# Altium schematic sheet Microcontroller.SchDoc
size B; SheetNumber: 11; SheetTotal: 11; TitleBlk1Sch: PCBA, LUCHADOR, REV 3.2b, AMBER; TitleBlk2Sch: Microcontroller; Eng: Haman; EngDate: 3-15-19; RevSch: 01
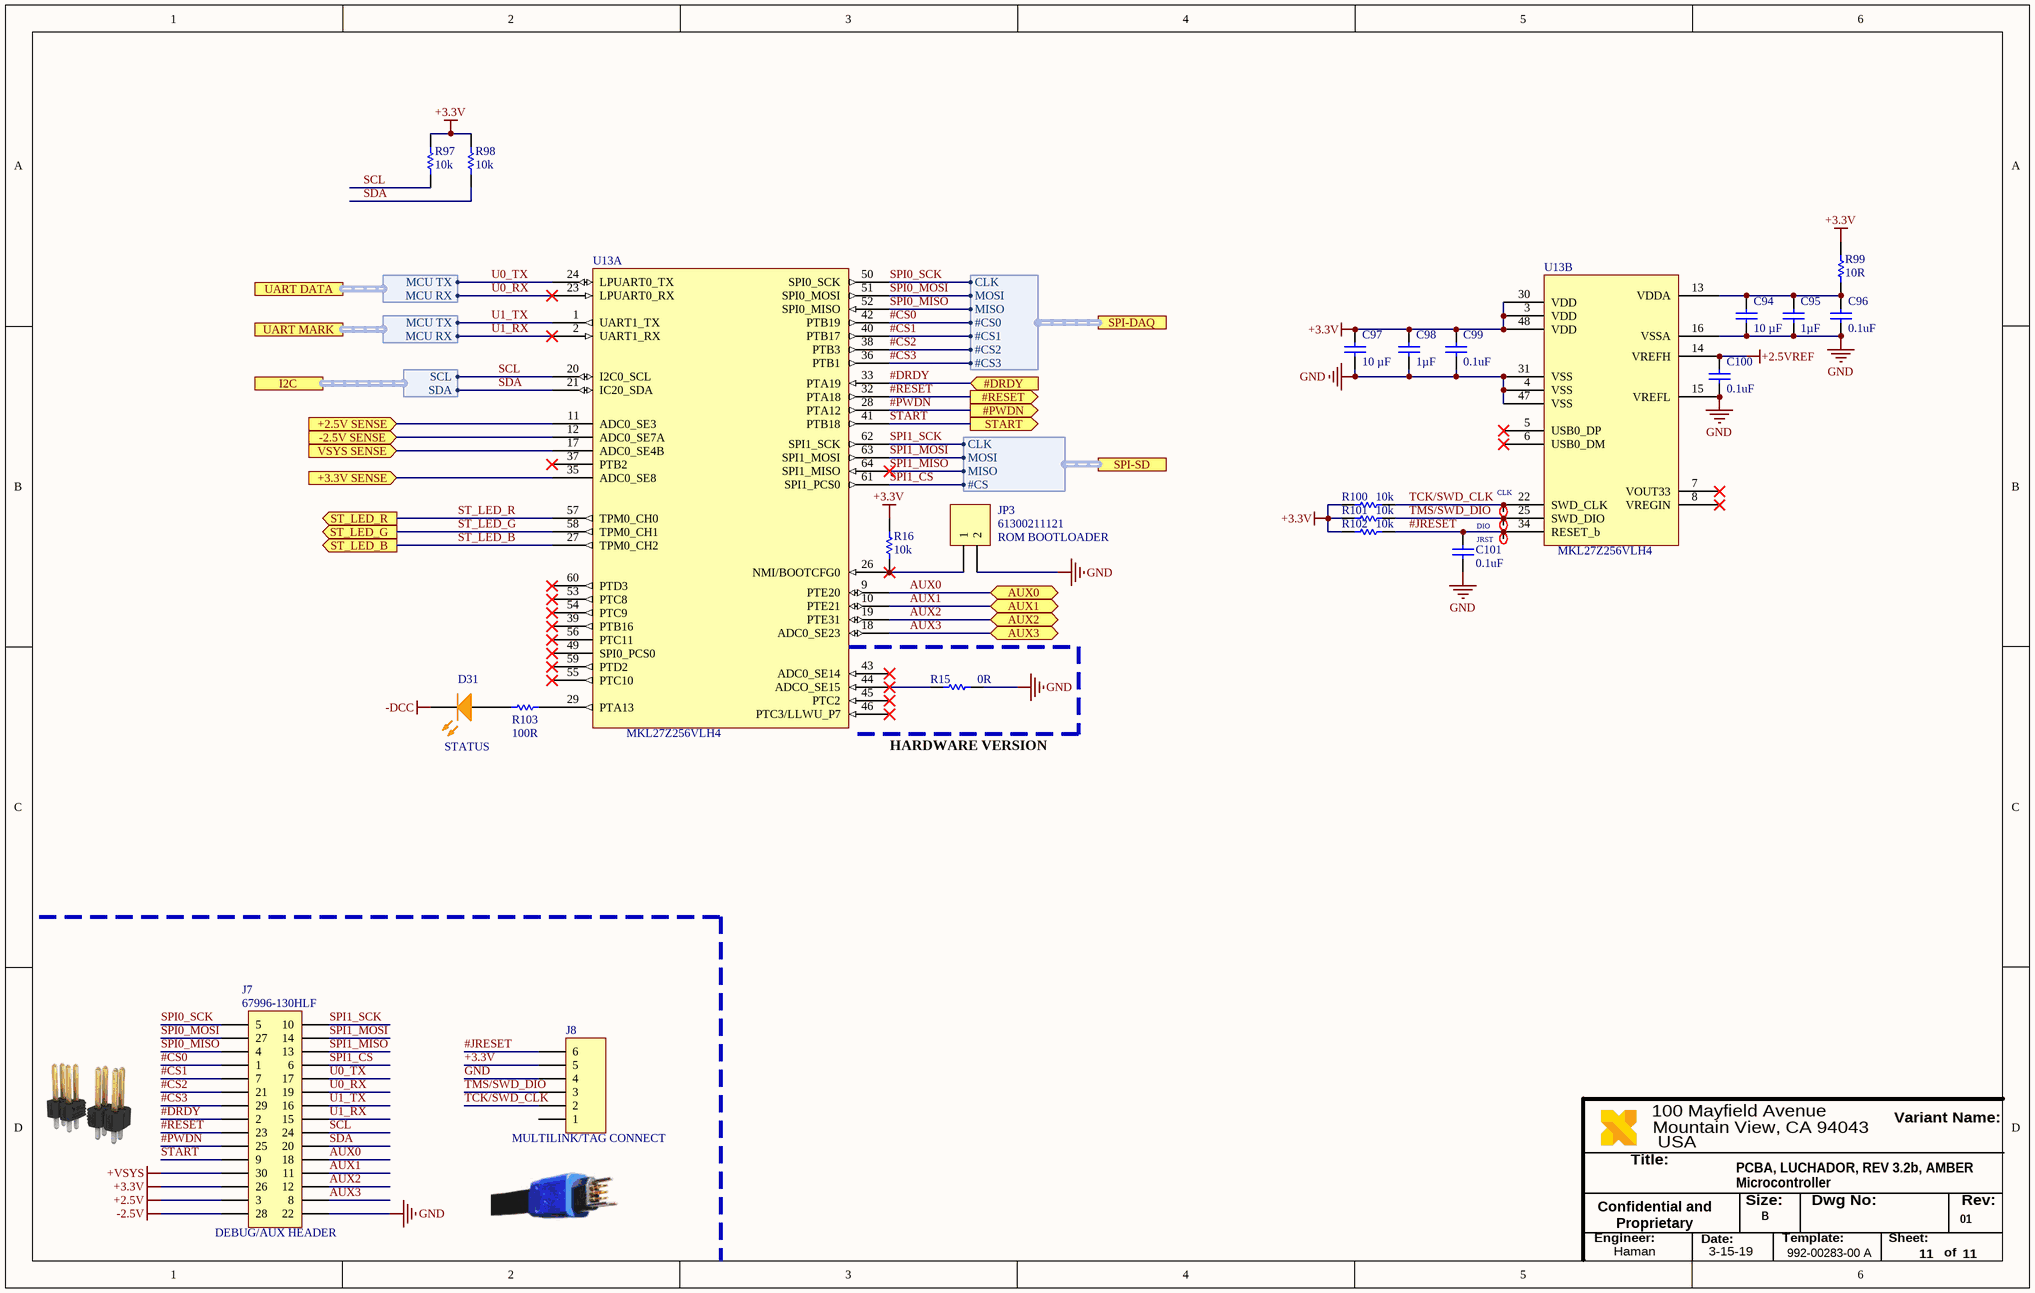
[diagram p0: Microcontroller.SchDoc]

## Parts
C94  Capacitance: 10 µF  [0603C]  (hidden comment: 50V)
C95  Capacitance: 1µF  [0402C]  (hidden comment: 50V)
C96  Capacitance: 0.1uF  [0402C]  (hidden comment: 50V)
C97  Capacitance: 10 µF  [0603C]  (hidden comment: 50V)
C98  Capacitance: 1µF  [0402C]  (hidden comment: 50V)
C99  Capacitance: 0.1uF  [0402C]  (hidden comment: 50V)
C100  Capacitance: 0.1uF  [0402C]  (hidden comment: 50V)
C101  Capacitance: 0.1uF  [0402C]  (hidden comment: 50V)
CLK  5001  [KEYSTONE TP]  (value not drawn)  (no BOM)
D31  STATUS  [0402L-ORANGE]
DIO  5001  [KEYSTONE TP]  (value not drawn)  (no BOM)
J7  DEBUG/AUX HEADER  [67996-130HLF]
J8  MULTILINK/TAG CONNECT  [TAG_CONNECT]  (no BOM)
JP3  ROM BOOTLOADER  [61300211121]
JRST  5001  [KEYSTONE TP]  (value not drawn)  (no BOM)
R15  Resistance (Ohms): 0R  [0402R]  (hidden comment: Res 0805)
R16  Resistance: 10k  [0402R]  (hidden comment: Res 0805)
R97  Resistance: 10k  [0402R]  (hidden comment: Res 0805)
R98  Resistance: 10k  [0402R]  (hidden comment: Res 0805)
R99  Resistance: 10R  [0402R]  (hidden comment: Res 0805)
R100  Resistance: 10k  [0402R]  (hidden comment: Res 0805)
R101  Resistance: 10k  [0402R]  (hidden comment: Res 0805)
R102  Resistance: 10k  [0402R]  (hidden comment: Res 0805)
R103  Resistance: 100R  [0402R]  (hidden comment: Res 0805)
U13  Manufacturer Part Number: MKL27Z256VLH4  [LQFP-64]  (hidden comment: MKL26Z256VLH4)  (parts A,B of 2)

## Ports
#DRDY (in), #PWDN (out), #RESET (out), +2.5V SENSE (in), +3.3V SENSE (in), -2.5V SENSE (in), AUX0 (bidir), AUX1 (bidir), AUX2 (bidir), AUX3 (bidir), I2C (harness I2C), SPI-DAQ (harness SPI-DAQ), SPI-SD (harness SPI-SD), ST_LED_B (out), ST_LED_G (out), ST_LED_R (out), START (out), UART DATA (harness UART), UART MARK (harness UART), VSYS SENSE (in)

## Harnesses
UART: MCU TX, MCU RX
I2C: SCL, SDA
SPI-DAQ: MOSI, MISO, CLK, #CS0, #CS1, #CS2, #CS3
SPI-SD: MISO, MOSI, CLK, #CS

## Nets
+2.5V: J7.3
+2.5VREF: C100.1 U13.14(VREFH)
+3.3V: C97.1 C98.1 C99.1 J7.26 J8.5 R16.2 R97.2 R98.2 R99.2 R100.1 R101.1 R102.1 U13.3(VDD) U13.30(VDD) U13.48(VDD)
+VSYS: J7.30
-2.5V: J7.28
-DCC: D31.2(K)
GND: C94.2 C95.2 C96.2 C97.2 C98.2 C99.2 C100.2 C101.2 J7.22 J8.4 JP3.2 R15.2 U13.4(VSS) U13.15(VREFL) U13.16(VSSA) U13.31(VSS) U13.47(VSS)
#CS0: J7.1 U13.42(PTB19) ; port SPI-DAQ.#CS0
#CS1: J7.7 U13.40(PTB17) ; port SPI-DAQ.#CS1
#CS2: J7.21 U13.38(PTB3) ; port SPI-DAQ.#CS2
#CS3: J7.29 U13.36(PTB1) ; port SPI-DAQ.#CS3
#DRDY: J7.2 U13.33(PTA19) ; port #DRDY
#JRESET: C101.1 J8.6 JRST.1 R102.2 U13.34(RESET_b)
#PWDN: J7.25 U13.28(PTA12) ; port #PWDN
#RESET: J7.23 U13.32(PTA18) ; port #RESET
+2.5V SENSE: U13.11(ADC0_SE3) ; port +2.5V SENSE
+3.3V SENSE: U13.35(ADC0_SE8) ; port +3.3V SENSE
-2.5V SENSE: U13.12(ADC0_SE7A) ; port -2.5V SENSE
AUX0: J7.18 U13.9(PTE20) ; port AUX0
AUX1: J7.11 U13.10(PTE21) ; port AUX1
AUX2: J7.12 U13.19(PTE31) ; port AUX2
AUX3: J7.8 U13.18(ADC0_SE23) ; port AUX3
SCL: J7.24 R97.1 U13.20(I2C0_SCL) ; port I2C.SCL
SDA: J7.20 R98.1 U13.21(IC20_SDA) ; port I2C.SDA
SPI0_MISO: J7.4 U13.52(SPI0_MISO) ; port SPI-DAQ.MISO
SPI0_MOSI: J7.27 U13.51(SPI0_MOSI) ; port SPI-DAQ.MOSI
SPI0_SCK: J7.5 U13.50(SPI0_SCK) ; port SPI-DAQ.CLK
SPI1_CS: J7.6 U13.61(SPI1_PCS0) ; port SPI-SD.#CS
SPI1_MISO: J7.13 U13.64(SPI1_MISO) ; port SPI-SD.MISO
SPI1_MOSI: J7.14 U13.63(SPI1_MOSI) ; port SPI-SD.MOSI
SPI1_SCK: J7.10 U13.62(SPI1_SCK) ; port SPI-SD.CLK
ST_LED_B: U13.27(TPM0_CH2) ; port ST_LED_B
ST_LED_G: U13.58(TPM0_CH1) ; port ST_LED_G
ST_LED_R: U13.57(TPM0_CH0) ; port ST_LED_R
START: J7.9 U13.41(PTB18) ; port START
TCK/SWD_CLK: CLK.1 J8.2 R100.2 U13.22(SWD_CLK)
TMS/SWD_DIO: DIO.1 J8.3 R101.2 U13.25(SWD_DIO)
U0_RX: J7.19 U13.23(LPUART0_RX) ; port UART DATA.MCU RX
U0_TX: J7.17 U13.24(LPUART0_TX) ; port UART DATA.MCU TX
U1_RX: J7.15 U13.2(UART1_RX) ; port UART MARK.MCU RX
U1_TX: J7.16 U13.1(UART1_TX) ; port UART MARK.MCU TX
VSYS SENSE: U13.17(ADC0_SE4B) ; port VSYS SENSE
NetC94_1: C94.1 C95.1 C96.1 R99.1 U13.13(VDDA)
NetD31_1: D31.1(A) R103.1
NetJP3_1: JP3.1 R16.1 U13.26(NMI/BOOTCFG0)
NetR15_1: R15.1 U13.44(ADCO_SE15)
NetR103_2: R103.2 U13.29(PTA13)

Not connected (* = marked no-connect by the designer): J8 1; U13 5(USB0_DP)* 6(USB0_DM)* 7(VOUT33)* 8(VREGIN)* 37(PTB2)* 39(PTB16)* 43(ADC0_SE14)* 45(PTC2)* 46(PTC3/LLWU_P7)* 49(SPI0_PCS0)* 53(PTC8)* 54(PTC9)* 55(PTC10)* 56(PTC11)* 59(PTD2)* 60(PTD3)*

## Notes on the sheet
- HARDWARE VERSION
- Title:
- USA
- 100 Mayfield Avenue
- Mountain View, CA 94043
- Variant Name:
- Confidential and Proprietary
- Engineer:
- Date:
- Size:
- B
- Template:
- 992-00283-00 A
- Dwg No:
- Sheet:
- Rev:
- of

## Library data of the parts
C94 C97 = Cap: CAP .1UF 50V CERAMIC Y5V 0805; Manufacturer: Samsung; Manufacturer Part Number: CL10B106MQ8NRNC; Description1: 10µF ±20% 6.3V X7R Ceramic Capacitor -55°C ~ 125°C Surface Mount, MLCC 0603 (1608 Metric) 0.063" L x 0.031" W (1.60mm x 0.80mm); Dielectric: X7R; Tolerance (%): ±20 %; Rated Voltage: 6.3 V; Revision: July-2002: Re-released for DXP Platform.; Supplier 1: Digi-Key; Supplier Part Number 1: 1276-1948-1-ND; Stock 1: 40000; Pricing 1: 1=1.07, 10=0.813, 100=0.5813, 500=0.45, 1000=0.3875 (USD); Case Size/Dimension: 0603; ComponentLink1URL: https://datasheet.ciiva.com/25723/cl10b106mq8nrnc-25723233.pdf; ComponentLink1Description: https://datasheet.ciiva.com/25723/cl10b106mq8nrnc-25723233.pdf; ComponentLink2URL: https://datasheet.ciiva.com/16428/cl10b106mq8nrnc-16428858.pdf; ComponentLink2Description: https://datasheet.ciiva.com/16428/cl10b106mq8nrnc-16428858.pdf
C95 C98 = Cap: CAP .1UF 50V CERAMIC Y5V 0805; Manufacturer: TDK; Manufacturer Part Number: CGB2A1JB1C105K033BC; PCN Part Number: MLCC Part Number Change 30/Nov/2012; Description1: 1µF ±10% 16V JB Ceramic Capacitor -25°C ~ 85°C Surface Mount, MLCC 0402 (1005 Metric) 0.039" L x 0.020" W (1.00mm x 0.50mm); Product Training Modules: SEAT, CCV, and TVCL Design Tools Guide to Replacing an Electrolytic Capacitor with an MLCC; Featured Product: CGB Series Capacitors CH and JB Temperature Coefficient Capacitors; EDA / CAD Models: Download from Accelerated Designs; Tolerance: ±10%; Voltage - Rated: 16V; Temperature Coefficient: JB; Online Catalog: CGB Series; Other Names: 445-12011-6; Revision: July-2002: Re-released for DXP Platform.; Supplier 1: Digi-Key; Supplier Part Number 1: 445-12011-1-ND; Stock 1: 7430; Pricing 1: 1=0.22, 10=0.151, 100=0.0765, 500=0.0523, 1000=0.0463, 2500=0.0443, 5000=0.0403 (USD); RoHS Information: RoHS Certificate-MLCC; Standard Package: 1; Category: Capacitors; Family: Ceramic Capacitors; Series: CGB; Packaging: Digi-Reel®; Mounting Type: Surface Mount, MLCC; Operating Temperature: -25°C ~ 85°C; Applications: General Purpose; Package / Case: 0402 (1005 Metric); Size / Dimension: 0.039" L x 0.020" W (1.00mm x 0.50mm); Thickness (Max): 0.013" (0.33mm); Features: Low Profile; ComponentLink1URL: https://product.tdk.com/info/en/catalog/datasheets/mlcc_commercial_lowprofile_en.pdf; ComponentLink1Description: https://product.tdk.com/info/en/catalog/datasheets/mlcc_commercial_lowprofile_en.pdf; ComponentLink2URL: https://product.tdk.com/info/en/catalog/spec/mlccspec_commercial_lowprofile_en.pdf; ComponentLink2Description: https://product.tdk.com/info/en/catalog/spec/mlccspec_commercial_lowprofile_en.pdf; ComponentLink3URL: http://product.tdk.com/en/catalog/datasheets/mlcc_commercial_lowprofile_en.pdf; ComponentLink3Description: http://product.tdk.com/en/catalog/datasheets/mlcc_commercial_lowprofile_en.pdf
C96 C99-C101 = Cap: CAP .1UF 50V CERAMIC Y5V 0805; Manufacturer: Kyocera AVX; Manufacturer Part Number: 0402YD104KAT2A; Description1: AVX   0402YD104KAT2A   Multilayer Ceramic Capacitor, 0.1 F,  10%, X5R, 16 V, 0402 [1005 Metric]; Dielectric: X5R; Tolerance (%): ±10 %; Rated Voltage: 16 V; Revision: July-2002: Re-released for DXP Platform.; Supplier 1: Digi-Key; Supplier Part Number 1: 478-1126-1-ND; Stock 1: 0; Pricing 1: 1=0.1, 10=0.047, 100=0.0211, 500=0.0151, 1000=0.0119, 2500=0.0108, 5000=0.0099 (USD); Case Size/Dimension: 0402; ComponentLink1URL: https://datasheet.ciiva.com/2987/cx5r-2987712.pdf; ComponentLink1Description: https://datasheet.ciiva.com/2987/cx5r-2987712.pdf; ComponentLink2URL: https://datasheet.ciiva.com/150/cx5r-150353.pdf; ComponentLink2Description: https://datasheet.ciiva.com/150/cx5r-150353.pdf; ComponentLink3URL: https://datasheet.ciiva.com/150/cx5r-150354.pdf; ComponentLink3Description: https://datasheet.ciiva.com/150/cx5r-150354.pdf; ComponentLink4URL: https://datasheet.ciiva.com/11786/0900766b80def1a5-11786866.pdf; ComponentLink4Description: https://datasheet.ciiva.com/11786/0900766b80def1a5-11786866.pdf; ComponentLink5URL: https://datasheet.ciiva.com/150/cx5r-150355.pdf; ComponentLink5Description: https://datasheet.ciiva.com/150/cx5r-150355.pdf; ComponentLink6URL: https://datasheet.ciiva.com/1124/1666675-1124009.pdf; ComponentLink6Description: https://datasheet.ciiva.com/1124/1666675-1124009.pdf; ComponentLink7URL: https://datasheet.ciiva.com/5423/cx5r-33896-5423625.pdf; ComponentLink7Description: https://datasheet.ciiva.com/5423/cx5r-33896-5423625.pdf; ComponentLink8URL: https://datasheet.ciiva.com/1124/1666675-1124010.pdf; ComponentLink8Description: https://datasheet.ciiva.com/1124/1666675-1124010.pdf; ComponentLink9URL: https://datasheet.ciiva.com/14590/70001028-14590205.pdf; ComponentLink9Description: https://datasheet.ciiva.com/14590/70001028-14590205.pdf; ComponentLink10URL: https://datasheet.ciiva.com/14592/70001028-14592157.pdf; ComponentLink10Description: https://datasheet.ciiva.com/14592/70001028-14592157.pdf; ComponentLink11URL: https://datasheet.ciiva.com/16623/cx5r-16623293.pdf; ComponentLink11Description: https://datasheet.ciiva.com/16623/cx5r-16623293.pdf; ComponentLink12URL: https://datasheet.ciiva.com/34303/1928960-34303277.pdf; ComponentLink12Description: https://datasheet.ciiva.com/34303/1928960-34303277.pdf; ComponentLink13URL: https://datasheet.ciiva.com/2987/cx5r-2987711.pdf; ComponentLink13Description: https://datasheet.ciiva.com/2987/cx5r-2987711.pdf
CLK DIO JRST = 5001: Manufacturer: Keystone Electronics; Description1: TEST POINT PC MINI .040"D BLACK; Supplier 1: Digi-Key; Manufacturer Part Number: 5001; RoHS: RoHS Compliant; Category: Test and Measurement; Stock 1: 159085; Pricing 1: 1=0.34, 10=0.315, 50=0.2296, 100=0.2206, 250=0.19812, 500=0.1891, 1000=0.15759, 2500=0.14408, 5000=0.13508 (USD); Packaging: Bulk; Type: PC Test Point, Miniature; Terminal: 0.010" x 0.020" (0.25mm x 0.51mm) Phosphor Bronze Wire, Silver Plated; Mounting Type: 0.040" (1.02mm) Hole Diameter; Material: Base, Nylon 46, UL 94V-0; Color: Black; ComponentLink1URL: http://www.keyelco.com/product-pdf.cfm?p=1310; ComponentLink1Description: http://www.keyelco.com/product-pdf.cfm?p=1310; Supplier Part Number 1: 5001K-ND
D31 = LED0_1: Typical INFRARED GaAs LED; Manufacturer: Vishay; Manufacturer Part Number: VLMO1500-GS08; Description1: Standard LEDs - SMD 0402 SOFT ORANGE Non-Diff; Illumination Color: Orange; Wavelength/Color Temperature: 605 nm; Luminous Intensity: 90 mcd; Viewing Angle: 130 deg; Lens Color/Style: Water Clear; If - Forward Current: 30 mA; Vf - Forward Voltage: 2 V; Power Rating: 75 mW; Brand: Vishay Semiconductors; Supplier 1: Digi-Key; Supplier Part Number 1: VLMO1500-GS08CT-ND; Stock 1: 194938; Pricing 1: 1=0.53, 10=0.38, 25=0.2916, 100=0.1901, 250=0.1394, 500=0.1183, 1000=0.0972 (USD); Product Category: Standard LEDs - SMD; RoHS: True; Package / Case: 0402 (1005 metric); Length: 1 mm; Height: 0.35 mm; Width: 0.5 mm; Minimum Operating Temperature: - 30 C; Maximum Operating Temperature: + 85 C; Series: VLMx; Packaging: Reel; Mounting Style: SMD/SMT; Factory Pack Quantity: 9000; Tradename: ChipLED; ComponentLink1URL: https://datasheet.ciiva.com/13945/vlmo1500-13945355.pdf; ComponentLink1Description: https://datasheet.ciiva.com/13945/vlmo1500-13945355.pdf; ComponentLink2URL: https://datasheet.ciiva.com/13945/vlmo1500-13945356.pdf; ComponentLink2Description: https://datasheet.ciiva.com/13945/vlmo1500-13945356.pdf; ComponentLink3URL: https://datasheet.ciiva.com/13945/vlmo1500-13945357.pdf; ComponentLink3Description: https://datasheet.ciiva.com/13945/vlmo1500-13945357.pdf
J7 = Header 15X2: Header, 15-Pin, Dual row; Manufacturer: Amphenol FCI; Description1: 30 Positions Header, Unshrouded Connector 0.100" (2.54mm) Through Hole Gold or Gold, GXT™; Pitch Spacing: 2.54mm; No. of Rows: 2; No. of Contacts: 30; Contact Termination: Through Hole Vertical; Supplier 1: Digi-Key; Supplier Part Number 1: 609-3456-ND; Manufacturer Part Number: 67996-130HLF; Stock 1: 2645; Pricing 1: 1=1.42, 10=1.29, 100=1.1057, 500=0.9214, 1000=0.7898, 5000=0.7003, 10000=0.6845 (USD); Series: BergStik; Gender: Header; Contact Plating: Gold; Contact Material: Phosphor Bronze; ComponentLink1URL: https://datasheet.ciiva.com/731/67996-731064.pdf; ComponentLink1Description: https://datasheet.ciiva.com/731/67996-731064.pdf; ComponentLink2URL: https://datasheet.ciiva.com/5154/67996-223389-5154298.pdf; ComponentLink2Description: https://datasheet.ciiva.com/5154/67996-223389-5154298.pdf; ComponentLink3URL: https://datasheet.ciiva.com/46396/1876884-46396011.pdf; ComponentLink3Description: https://datasheet.ciiva.com/46396/1876884-46396011.pdf; ComponentLink4URL: https://datasheet.ciiva.com/10119/67996-10119327.pdf; ComponentLink4Description: https://datasheet.ciiva.com/10119/67996-10119327.pdf
J8 = Header 6: Header, 6-Pin
JP3 = Header 2: Header, 2-Pin; Manufacturer: Wurth Electronics; Description1: Headers & Wire Housings WR-PHD 2.54mm Header 2P THT; Number of Positions / Contacts: 2; Pitch: 2.54 mm; Mounting Angle: Straight; Current Rating: 3 A; Latching Type: Unlatched; Voltage Rating: 250 V; Supplier 1: Digi-Key; Supplier Part Number 1: 732-5315-ND; Manufacturer Part Number: 61300211121; Stock 1: 53953; Pricing 1: 1=0.13, 10=0.106, 25=0.088, 50=0.074, 100=0.067, 1000=0.061 (USD); Mounting Style: Through Hole; Product Category: Headers & Wire Housings; RoHS: Details; Series: WR-PHD; Product Type: Headers; Type: Pin Strip; Number of Positions: 2; Number of Rows: 1; Contact Gender: Pin (Male); Contact Plating: Gold; Housing Material: Polybutylene Terephthalate (PBT); Termination Style: Through Hole; Brand: Wurth Electronics; Contact Material: Copper Alloy; Operating Temperature Range: - 40 C to + 125 C; Packaging: Bulk
R15 = Res 0805: Resistor; Manufacturer: Panasonic; Manufacturer Part Number: ERJ-2GE0R00X; Description1: Res Thick Film 0402 0 Ohm Molded SMD Automotive T/R; EDA / CAD Models: Download from Accelerated Designs; Tolerance: Jumper; Power (Watts): 0.1W, 1/10W; Online Catalog: ERJ Series; Other Names: P0.0JDKR; Supplier 1: Digi-Key; Supplier Part Number 1: P0.0JCT-ND; Stock 1: 31263960; Pricing 1: 1=0.1, 10=0.037, 25=0.0268, 50=0.0204, 100=0.015, 250=0.0114, 500=0.0091, 1000=0.0067, 5000=0.0048 (USD); Standard Package: 1; Category: Resistors; Family: Chip Resistor - Surface Mount; Series: ERJ; Packaging: Digi-Reel®; Composition: Thick Film; Features: Automotive AEC-Q200; Temperature Coefficient: -; Operating Temperature: -55°C ~ 155°C; Package / Case: 0402 (1005 Metric); Supplier Device Package: 0402; Size / Dimension: 0.039" L x 0.020" W (1.00mm x 0.50mm); Height: 0.016" (0.40mm); Number of Terminations: 2; ComponentLink1URL: https://datasheet.ciiva.com/48531/aoa0000ce1-48531077.pdf; ComponentLink1Description: https://datasheet.ciiva.com/48531/aoa0000ce1-48531077.pdf; ComponentLink2URL: https://datasheet.ciiva.com/16783/70260739-16783734.pdf; ComponentLink2Description: https://datasheet.ciiva.com/16783/70260739-16783734.pdf; ComponentLink3URL: https://datasheet.ciiva.com/11821/0900766b80f806dd-11821176.pdf; ComponentLink3Description: https://datasheet.ciiva.com/11821/0900766b80f806dd-11821176.pdf; ComponentLink4URL: https://datasheet.ciiva.com/17215/aoa0000ce1-17215386.pdf; ComponentLink4Description: https://datasheet.ciiva.com/17215/aoa0000ce1-17215386.pdf; ComponentLink5URL: https://datasheet.ciiva.com/43460/1678796-43460347.pdf; ComponentLink5Description: https://datasheet.ciiva.com/43460/1678796-43460347.pdf; ComponentLink6URL: https://datasheet.ciiva.com/5959/1678796-5959692.pdf; ComponentLink6Description: https://datasheet.ciiva.com/5959/1678796-5959692.pdf; ComponentLink7URL: https://datasheet.ciiva.com/30097/4aoa0000ce1-30097116.pdf; ComponentLink7Description: https://datasheet.ciiva.com/30097/4aoa0000ce1-30097116.pdf; ComponentLink8URL: https://datasheet.ciiva.com/28695/1678796-28695758.pdf; ComponentLink8Description: https://datasheet.ciiva.com/28695/1678796-28695758.pdf; ComponentLink9URL: https://datasheet.ciiva.com/46389/1678796-46389518.pdf; ComponentLink9Description: https://datasheet.ciiva.com/46389/1678796-46389518.pdf; ComponentLink10URL: https://datasheet.ciiva.com/16778/70260739-16778335.pdf; ComponentLink10Description: https://datasheet.ciiva.com/16778/70260739-16778335.pdf
R16 R97 R98 R100-R102 = Res 0805: Resistor; Manufacturer: Samsung; Manufacturer Part Number: RC1005F103CS; Description1: Res Thick Film 0402 10K Ohm 1% 0.063W(1/16W) ±100ppm/C Molded SMD T/R; Rated Power: 0.063 W; Tolerance (%): ±1 %; Temp Coefficient: ±100 ppm/°C; Supplier 1: Digi-Key; Supplier Part Number 1: 1276-3431-1-ND; Stock 1: 15935883; Pricing 1: 1=0.1, 10=0.021, 100=0.0087, 1000=0.0039, 2500=0.0034, 5000=0.0028 (USD); Size Code: 0402; ComponentLink1URL: https://datasheet.ciiva.com/15196/getdatasheetpartid-504789-15196214.pdf; ComponentLink1Description: https://datasheet.ciiva.com/15196/getdatasheetpartid-504789-15196214.pdf; ComponentLink2URL: https://datasheet.ciiva.com/16481/rcseries-16481007.pdf; ComponentLink2Description: https://datasheet.ciiva.com/16481/rcseries-16481007.pdf
R99 = Res 0805: Resistor; Manufacturer: Panasonic; Manufacturer Part Number: ERJ-2RKF10R0X; Description1: Res Thick Film 0402 10 Ohm 1% 0.1W(1/10W) ±100ppm/C Molded SMD Automotive Punched T/R; Rated Power: 0.1 W; Tolerance (%): ±1 %; Temp Coefficient: ±100 ppm/°C; Supplier 1: Digi-Key; Supplier Part Number 1: P10.0LCT-ND; Stock 1: 3489054; Pricing 1: 1=0.1, 10=0.056, 100=0.0227, 1000=0.0102, 2500=0.0089, 5000=0.0073 (USD); Size Code: 0402; ComponentLink1URL: https://datasheet.ciiva.com/11821/0900766b80f80784-11821168.pdf; ComponentLink1Description: https://datasheet.ciiva.com/11821/0900766b80f80784-11821168.pdf; ComponentLink2URL: https://datasheet.ciiva.com/7802/aoa0000ce2-7802405.pdf; ComponentLink2Description: https://datasheet.ciiva.com/7802/aoa0000ce2-7802405.pdf; ComponentLink3URL: https://datasheet.ciiva.com/16773/70260748-16773366.pdf; ComponentLink3Description: https://datasheet.ciiva.com/16773/70260748-16773366.pdf; ComponentLink4URL: https://datasheet.ciiva.com/43467/1678782-43467127.pdf; ComponentLink4Description: https://datasheet.ciiva.com/43467/1678782-43467127.pdf; ComponentLink5URL: https://datasheet.ciiva.com/9194/aoa0000ce2-9194120.pdf; ComponentLink5Description: https://datasheet.ciiva.com/9194/aoa0000ce2-9194120.pdf; ComponentLink6URL: https://datasheet.ciiva.com/30218/aoa0000ce2-30218536.pdf; ComponentLink6Description: https://datasheet.ciiva.com/30218/aoa0000ce2-30218536.pdf; ComponentLink7URL: https://datasheet.ciiva.com/17212/aoa0000ce2-17212057.pdf; ComponentLink7Description: https://datasheet.ciiva.com/17212/aoa0000ce2-17212057.pdf; ComponentLink8URL: https://datasheet.ciiva.com/24071/aoa0000ce2-24071514.pdf; ComponentLink8Description: https://datasheet.ciiva.com/24071/aoa0000ce2-24071514.pdf; ComponentLink9URL: https://datasheet.ciiva.com/27055/1987054-27055644.pdf; ComponentLink9Description: https://datasheet.ciiva.com/27055/1987054-27055644.pdf; ComponentLink10URL: https://datasheet.ciiva.com/6082/aoa0000ce2-6082046.pdf; ComponentLink10Description: https://datasheet.ciiva.com/6082/aoa0000ce2-6082046.pdf; ComponentLink11URL: https://datasheet.ciiva.com/22668/1678782-22668302.pdf; ComponentLink11Description: https://datasheet.ciiva.com/22668/1678782-22668302.pdf
R103 = Res 0805: Resistor; Manufacturer: Panasonic; Manufacturer Part Number: ERJ-2RKF1000X; Description1: Res Thick Film 0402 100 Ohm 1% 0.1W(1/10W) ±100ppm/C Molded SMD Automotive T/R; Rated Power: 0.1 W; Tolerance (%): ±1 %; Temp Coefficient: ±100 ppm/°C; Supplier 1: Digi-Key; Supplier Part Number 1: P100LCT-ND; Stock 1: 14075966; Pricing 1: 1=0.1, 10=0.056, 100=0.0227, 1000=0.0102, 2500=0.0089, 5000=0.0073 (USD); Size Code: 0402; ComponentLink1URL: https://datasheet.ciiva.com/27056/2007311-27056035.pdf; ComponentLink1Description: https://datasheet.ciiva.com/27056/2007311-27056035.pdf; ComponentLink2URL: https://datasheet.ciiva.com/11821/0900766b80f80784-11821173.pdf; ComponentLink2Description: https://datasheet.ciiva.com/11821/0900766b80f80784-11821173.pdf; ComponentLink3URL: https://datasheet.ciiva.com/46372/1678782-46372741.pdf; ComponentLink3Description: https://datasheet.ciiva.com/46372/1678782-46372741.pdf; ComponentLink4URL: https://datasheet.ciiva.com/16199/aoa0000ce2-16199575.pdf; ComponentLink4Description: https://datasheet.ciiva.com/16199/aoa0000ce2-16199575.pdf; ComponentLink5URL: https://datasheet.ciiva.com/43467/1678782-43467223.pdf; ComponentLink5Description: https://datasheet.ciiva.com/43467/1678782-43467223.pdf; ComponentLink6URL: https://datasheet.ciiva.com/30260/aoa0000ce2-30260809.pdf; ComponentLink6Description: https://datasheet.ciiva.com/30260/aoa0000ce2-30260809.pdf; ComponentLink7URL: https://datasheet.ciiva.com/9186/aoa0000ce2-9186683.pdf; ComponentLink7Description: https://datasheet.ciiva.com/9186/aoa0000ce2-9186683.pdf; ComponentLink8URL: https://datasheet.ciiva.com/16776/70260748-16776427.pdf; ComponentLink8Description: https://datasheet.ciiva.com/16776/70260748-16776427.pdf; ComponentLink9URL: https://datasheet.ciiva.com/48531/aoa0000ce2-48531067.pdf; ComponentLink9Description: https://datasheet.ciiva.com/48531/aoa0000ce2-48531067.pdf; ComponentLink10URL: https://datasheet.ciiva.com/17207/aoa0000ce2-17207980.pdf; ComponentLink10Description: https://datasheet.ciiva.com/17207/aoa0000ce2-17207980.pdf; ComponentLink11URL: https://datasheet.ciiva.com/7830/426256-7830973.pdf; ComponentLink11Description: https://datasheet.ciiva.com/7830/426256-7830973.pdf; ComponentLink12URL: https://datasheet.ciiva.com/16522/aoa0000ce2-16522621.pdf; ComponentLink12Description: https://datasheet.ciiva.com/16522/aoa0000ce2-16522621.pdf; ComponentLink13URL: https://datasheet.ciiva.com/28514/1678782-28514175.pdf; ComponentLink13Description: https://datasheet.ciiva.com/28514/1678782-28514175.pdf
U13 = MKL26Z256VLH4: Manufacturer: NXP Freescale; Description1: NXP   MKL27Z256VLH4   32 Bit Microcontroller, Kinetis L Series Ultra Low Power, ARM Cortex-M0+, 48 MHz, 256 KB, 32 KB; Core Processor: ARM® Cortex®-M0+; Core Size: 32-Bit; Speed: 48MHz; Connectivity: I²C, SPI, UART/USART, USB; Peripherals: DMA, I²S, LVD, POR, PWM, WDT; Number of I/O: 50; Program Memory Size: 256KB (256K x 8); Program Memory Type: FLASH; RAM Size: 32K x 8; Voltage - Supply (Vcc/Vdd): 1.71 V ~ 3.6 V; Data Converters: A/D 16x16b, D/A 1x12b; Oscillator Type: Internal; Supplier 1: Digi-Key; Supplier Part Number 1: MKL27Z256VLH4-ND; Stock 1: 23443; Pricing 1: 1=6.55, 10=5.879, 100=4.8165 (USD); Category: Integrated Circuits (ICs); Family: Embedded - Microcontrollers; Series: Kinetis KL2; Packaging: Tray; EEPROM Size: -; Operating Temperature: -40°C ~ 105°C (TA); Package / Case: 64-LQFP; Supplier Device Package: 64-LQFP (10x10)